# EAGLE design PGA-103+ VHF UHF (EAGLE 7.7.0)
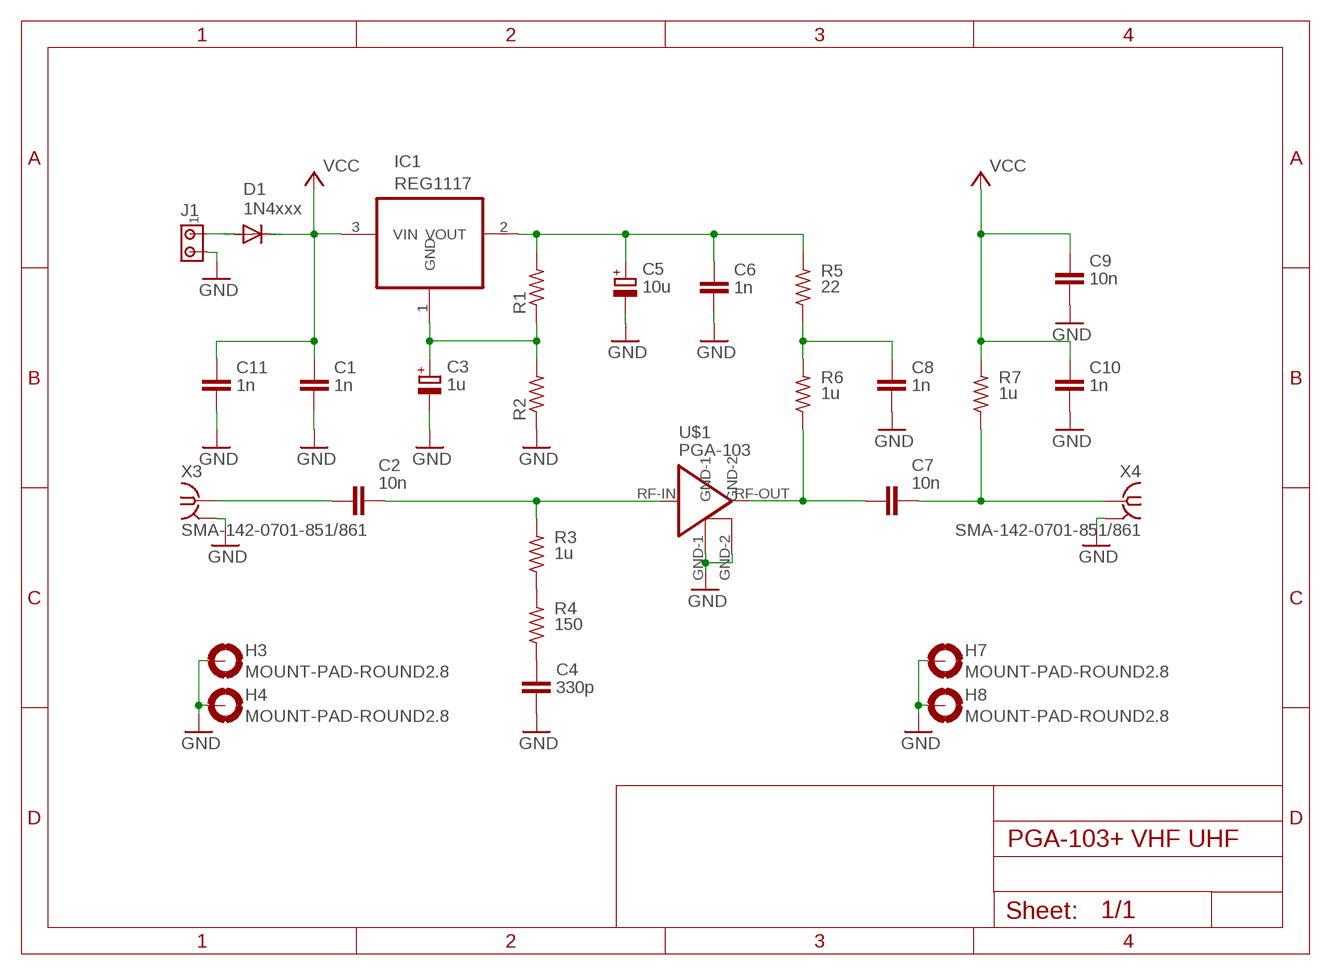
[diagram p0: schematic, sheet 1]

## Parts
C1  1n  C-EUC1206  [C1206]
C2  10n  C-EUC1206  [C1206]
C3  1u  CPOL-EUCT6032  [CT6032]
C4  330p  C-EUC1206  [C1206]
C5  10u  CPOL-EUCT6032  [CT6032]
C6  1n  C-EUC1206  [C1206]
C7  10n  C-EUC1206  [C1206]
C8  1n  C-EUC1206  [C1206]
C9  10n  C-EUC1206  [C1206]
C10  1n  C-EUC1206  [C1206]
C11  1n  C-EUC1206  [C1206]
D1  1N4xxx  1N4148DO35-7  [DO35-7]
H3  MOUNT-PAD-ROUND2.8  [2,8-PAD]
H4  MOUNT-PAD-ROUND2.8  [2,8-PAD]
H7  MOUNT-PAD-ROUND2.8  [2,8-PAD]
H8  MOUNT-PAD-ROUND2.8  [2,8-PAD]
IC1  REG1117  [SOT223]
J1  MTA02-156  [1X2MTA]
R1  R-US_M1206  [M1206]
R2  R-US_M1206  [M1206]
R3  1u  R-US_M1206  [M1206]
R4  150  R-US_M1206  [M1206]
R5  22  R-US_M1206  [M1206]
R6  1u  R-US_M1206  [M1206]
R7  1u  R-US_M1206  [M1206]
U$1  PGA-103  [DF782]
X3  SMA-142-0701-851/861  [J502-ND-142-0701-851/861]
X4  SMA-142-0701-851/861  [J502-ND-142-0701-851/861]

## Nets
GND: C1.2 C3.- C4.1 C5.- C6.2 C8.1 C9.1 C10.1 C11.2 H3.B2,8(MOUNT) H4.B2,8(MOUNT) H7.B2,8(MOUNT) H8.B2,8(MOUNT) J1.2 R2.1 U$1.GND-1 U$1.GND-2 X3.G@1 X3.G@2 X3.G@3 X3.G@4 X4.G@1 X4.G@2 X4.G@3 X4.G@4
N$1: C2.2 R3.2 U$1.RF-IN
N$2: C2.1 X3.1
N$3: C7.1 R6.1 U$1.RF-OUT
N$4: C7.2 R7.1 X4.1
N$5: C5.+ C6.1 IC1.2(VOUT) R1.2 R5.2
N$6: C3.+ IC1.1(GND) R1.1 R2.2
N$7: D1.A J1.1
N$9: C8.2 R5.1 R6.2
N$10: R3.1 R4.2
N$11: C4.2 R4.1
VCC: C1.1 C9.2 C10.2 C11.1 D1.C IC1.3(VIN) R7.2

## Library data of the parts
C1 C2 C4 C6-C11 = rcl:C-EU: CAPACITOR, European symbol
C3 C5 = rcl:CPOL-EU: POLARIZED CAPACITOR, European symbol
D1 = diode:1N4148: DIODE high speed (Philips)
H3 H4 H7 H8 = holes:MOUNT-PAD-ROUND: MOUNTING PAD, round
IC1 = burr-brown:REG1117: 800mA and 1A Low Dropout (LDO) Positive Regulator 1.8V, 2.5V, 2.85V, 3.3V, 5V, and Adj; MPN: REG1117; OC_FARNELL: 1097566; OC_NEWARK: 14P6981
J1 = con-amp:MTA02-156: AMP connector
R1-R7 = rcl:R-US_: RESISTOR, American symbol
U$1 = minicircuits:PGA-103
X3 X4 = con-coax:SMA-: SMA 50 Ohm End Launch Jack Receptacle - Round Contact Johnson Components Source: www.johnsoncomponents.com .. J502-ND.pdf; MF: JOHNSON COMPONENTS; MPN: 142-0701-851; OC_FARNELL: 1019325; OC_NEWARK: 99F6798

## Board
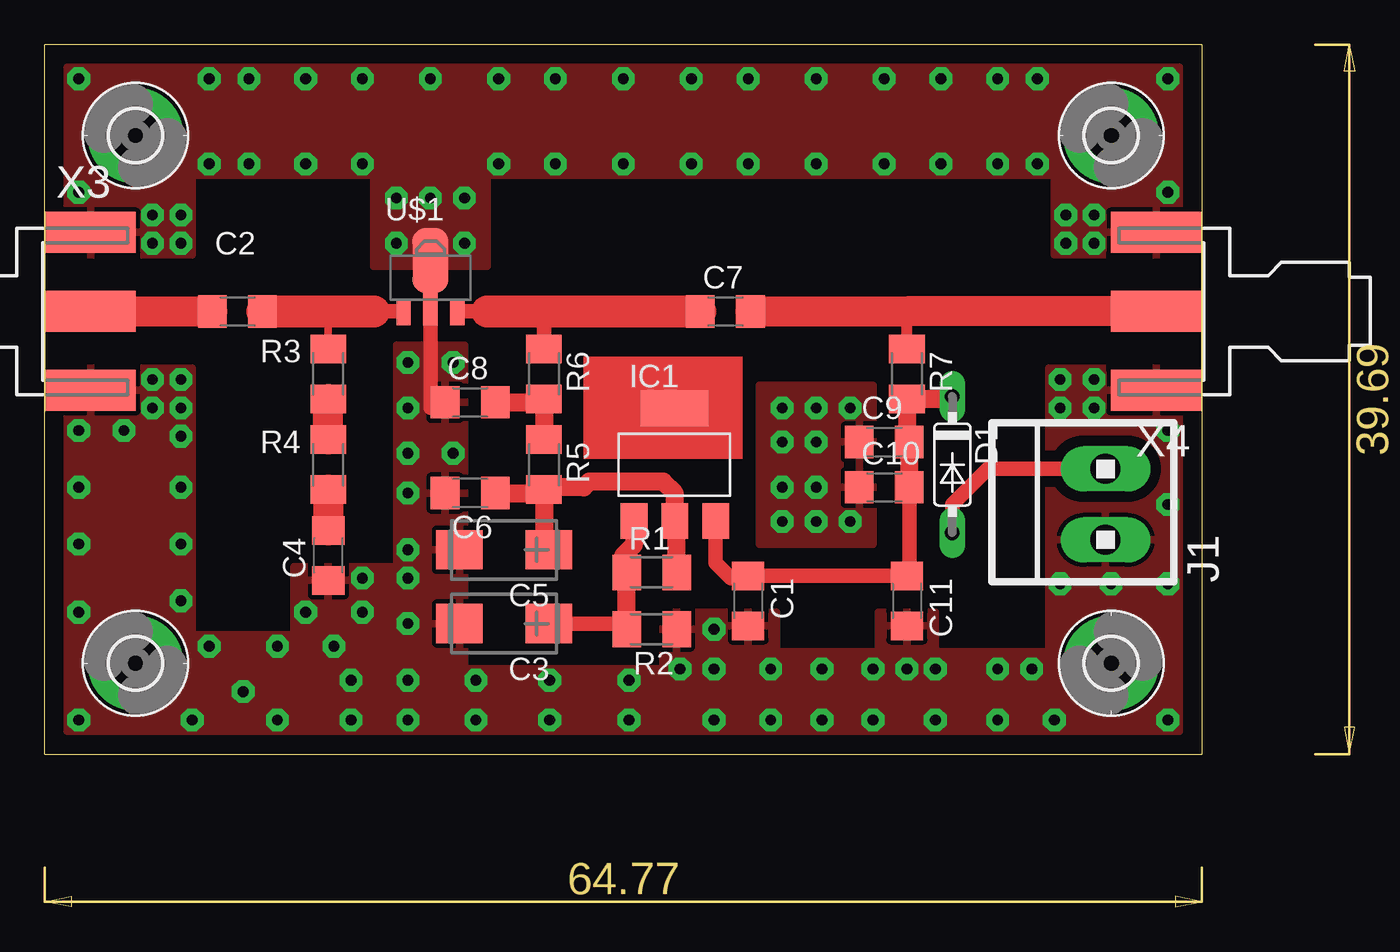
[diagram p1: board, top side]
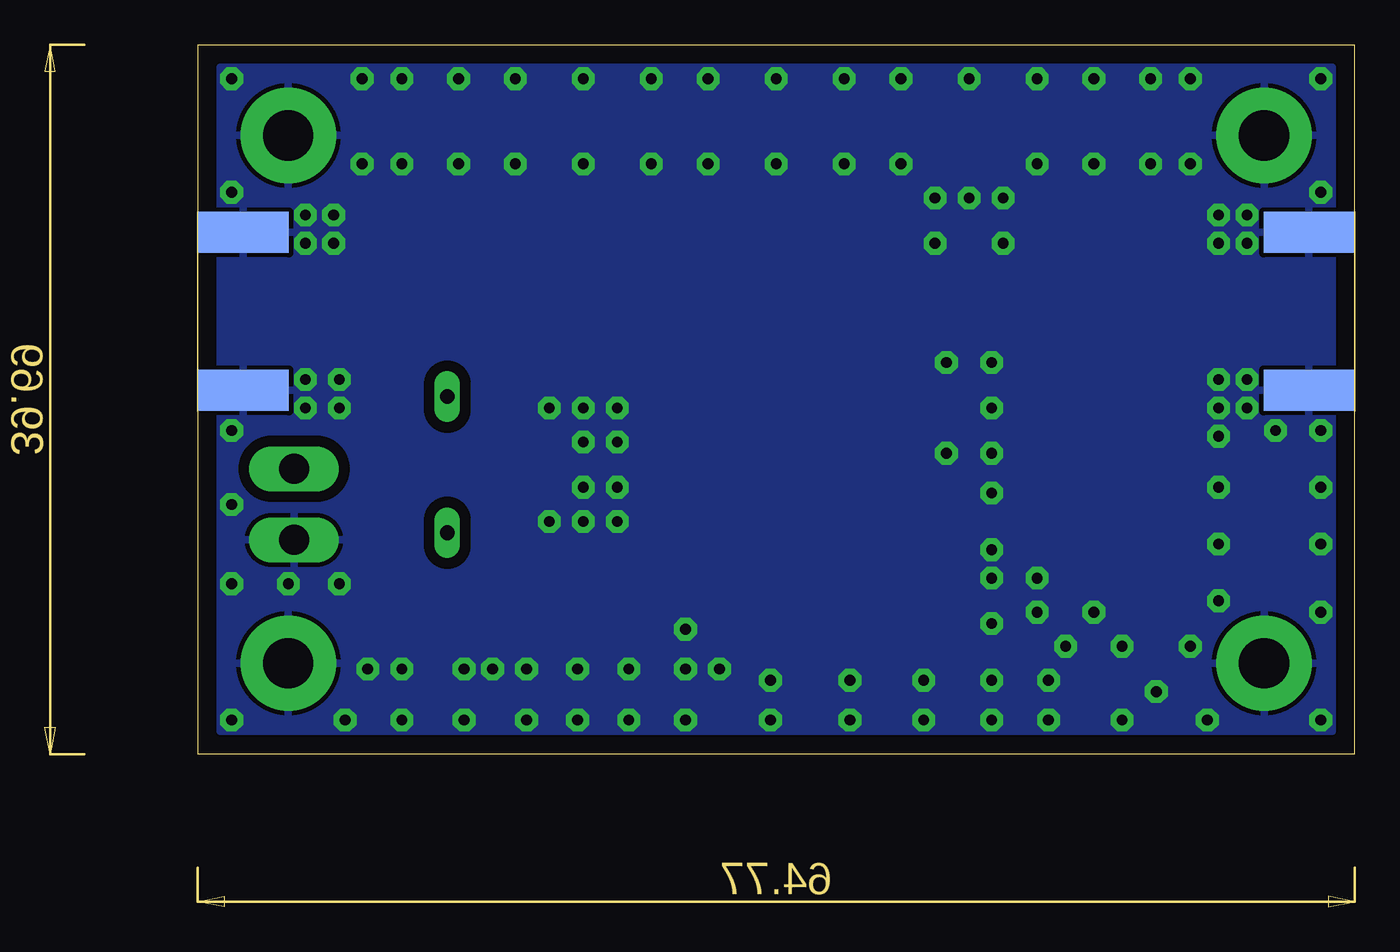
[diagram p2: board, bottom side, seen from below]

Size 64.77 x 39.69 mm. Coordinates in mm from the lower left corner, seen from the top.
Outline: 0,0 64.77,0 64.77,39.69 0,39.69 0,0
Copper layers (1*16): Top 0.035mm / dielectric 1.5mm / Bottom 0.035mm
Design rules "SparkFun *": minimum track width 5mil, minimum drill 20mil, track to track 5mil, track to pad 5mil, pad to pad 5mil, via to via 5mil, smd to smd 5mil, copper to edge 10mil, drill to drill 8mil, minimum pad ring 12mil, minimum via ring 10mil, stop-mask expansion 4mil, vias tented up to drill 25mil, thermal gap 10mil

### Footprints (pad centres in the part's own frame; a part is rotated, then mirrored left to right if it is on the bottom)
C1206 = smd 1.6 x 1.8: 1 -1.4,0; 2 1.4,0
CT6032 = smd 2.6 x 2.2: + -2.5,0; - 2.5,0
DO35-7 = drill 0.813 long: A 3.81,0; C -3.81,0
2,8-PAD = drill 2.8 pad 5.334: B2,8 0,0
SOT223 = smd 1.499 x 2.007: 1 -2.261,-3.15; 2 0.025,-3.15; 3 2.311,-3.15 | smd 3.81 x 2.007: 4 0,3.15
1X2MTA = drill 1.676 long: 1 1.981,0; 2 -1.981,0
M1206 = smd 1.6 x 2: 1 -1.4,0; 2 1.4,0
DF782 = smd 0.8 x 1.9: GND-1 0,-1.727 | smd 2.032 x 3.65: GND-2 0,0.94 | smd 0.8 x 1.4: RF-IN -1.499,-1.981; RF-OUT 1.499,-1.981
J502-ND-142-0701-851/861 = smd 5.08 x 2.286: 1 2.565,0; G@1 2.565,4.42; G@2 2.565,-4.42 | smd 5.08 x 2.286 bottom: G@3 2.565,4.42; G@4 2.565,-4.42

### Placement (x,y rotation side)
C1  39.37,8.57 270 top
C2  10.79,24.77 0 top
C3  25.72,7.3 180 top
C4  15.88,11.11 90 top
C5  25.72,11.43 180 top
C6  23.81,14.61 180 top
C7  38.1,24.77 0 top
C8  23.81,19.68 0 top
C9  46.99,17.46 0 top
C10  46.99,14.92 0 top
C11  48.26,8.57 270 top
D1  50.8,16.19 270 top
H3  5.08,5.08 90 top
H4  59.69,34.61 90 top
H7  59.69,5.08 180 top
H8  5.08,34.61 90 top
IC1  35.24,16.19 0 top
J1  59.37,13.97 90 top
R1  33.97,10.16 0 top
R2  33.97,6.99 180 top
R3  15.88,21.27 90 top
R4  15.88,16.19 90 top
R5  27.94,16.19 270 top
R6  27.94,21.27 270 top
R7  48.26,21.27 270 top
U$1  21.59,26.67 0 top
X3  0,24.77 0 top
X4  64.77,24.77 180 top

### Tracks (layer width: path | path; a pad name or v marks a point on that pad's centre or on a via)
GND  (via drill 0.6 pad 1.27)
  Top 0.813: U$1.GND-2 U$1.GND-1 21.59,19.37
  other vias: 20.32,21.91 20.32,19.37 17.78,9.84 13.02,1.91 20.32,1.91 43.5,4.76 48.26,4.76 20.32,11.43 22.86,16.83 20.32,9.84 20.32,7.3 14.61,7.94 43.18,14.92 45.09,19.37 7.62,20.95 7.62,19.37 7.62,14.92 7.62,11.75 7.62,8.57 8.26,1.91 9.21,6.03 13.02,6.03 56.83,20.95 62.87,13.97 56.83,9.53 55.24,4.76 56.52,1.91 46.35,1.91 43.5,1.91 40.64,1.91 37.47,1.91 32.7,1.91 28.26,1.91 24.13,1.91 1.91,18.1 6.03,19.37 62.87,18.1 1.91,14.92 1.91,11.75 1.91,7.94 1.91,1.91 11.11,3.49 35.56,4.76 16.19,6.03 17.14,4.13 24.13,4.13 28.26,4.13 32.7,4.13 37.47,4.76 40.64,4.76 49.85,4.76 49.85,1.91 53.34,1.91 53.34,4.76 62.87,9.53 62.87,1.91 59.69,9.53 17.78,33.02 25.4,33.02 23.5,28.57 19.68,28.57 7.62,28.57 57.15,28.57 7.62,30.16 9.21,33.02 11.43,33.02 28.57,33.02 32.38,33.02 14.61,33.02 36.2,33.02 39.37,33.02 46.99,33.02 50.16,33.02 53.34,33.02 57.15,30.16 6.03,30.16 58.74,30.16 1.91,31.43 1.91,37.78 9.21,37.78 62.87,37.78 55.56,37.78 55.56,33.02 62.87,31.43 11.43,37.78 14.61,37.78 28.57,37.78 32.38,37.78 36.2,37.78 39.37,37.78 46.99,37.78 50.16,37.78 53.34,37.78 17.78,37.78 25.4,37.78 19.68,31.11 23.5,31.11 22.86,21.91 20.32,16.83 43.18,13.02 43.18,17.46 43.18,19.37 45.09,13.02 41.27,13.02 41.27,19.37 41.27,17.46 41.27,14.92 20.32,4.13 46.35,4.76 37.47,6.99 17.78,7.94 17.14,1.91 21.59,31.11 20.32,14.61 43.18,33.02 43.18,37.78 21.59,37.78 6.03,28.57 6.03,20.95 58.74,28.57 58.74,20.95 58.74,19.37 56.83,19.37 7.62,17.78 4.45,18.1
  pour Top: 40.01,20.64 46.35,20.64 46.35,11.75 40.01,11.75
  pour Top: 8.26,27.94 1.27,27.94 1.27,38.42 63.5,38.42 63.5,27.94 56.52,27.94 56.52,32.38 8.26,32.38
  pour Bottom (isolate 0.61): 1.27,38.42 63.5,38.42 63.5,1.27 1.27,1.27
  pour Top (no thermals): 18.41,32.38 24.77,32.38 24.77,27.3 18.41,27.3
  pour Top (isolate 0.61): 1.27,21.59 8.26,21.59 8.26,6.67 13.97,6.67 13.97,10.48 19.68,10.48 19.68,22.86 23.5,22.86 23.5,4.76 34.61,4.76 34.61,7.94 40.96,7.94 40.96,5.71 46.67,5.71 46.67,7.94 49.85,7.94 49.85,5.71 56.2,5.71 56.2,21.59 63.5,21.59 63.5,1.27 1.27,1.27
N$1
  Top 0.406: R3.2 15.88,24.77
  Top 0.813: 18.41,24.77 20.09,24.77 U$1.RF-IN
  Top 1.778: C2.2 15.88,24.77 18.41,24.77
N$2
  Top 1.676: X3.1 C2.1
N$3
  Top 0.813: 24.77,24.77 23.09,24.77 U$1.RF-OUT | R6.1 27.94,24.77
  Top 1.778: 24.77,24.77 27.94,24.77 C7.1
N$4
  Top 0.61: R7.1 48.26,24.77
  Top 1.676: C7.2 48.26,24.77 X4.1
N$5
  Top 1.016: C6.1 27.75,14.61 R5.2 | R5.2 27.94,11.71 C5.+ | R1.2 35.37,12.94 IC1.2 35.27,14.58 34.61,15.24 30.48,15.24 30.16,14.92 28.07,14.92 R5.2
N$6
  Top 0.813: C3.+ 32.26,7.3 R2.2
  Top 1.016: R2.2 R1.1 32.38,10.35 32.38,11.11 32.98,11.71 IC1.1
N$7
  Top 0.813: J1.1 52.78,15.95 50.8,13.97 D1.A
N$9
  Top 1.016: R5.1 R6.2 27.75,19.68 C8.2
N$10
  Top 1.676: R4.2 R3.1
N$11
  Top 1.676: R4.1 C4.2
VCC
  Top 0.813: C10.2 48.39,10.1 C11.1 C1.1 39.24,9.84 38.42,9.84 37.55,10.71 IC1.3
  Top 1.016: C10.2 C9.2 48.26,17.59 R7.2 50.67,19.87 D1.C
(copper drawn outside any net)
  shapes: Top area x1